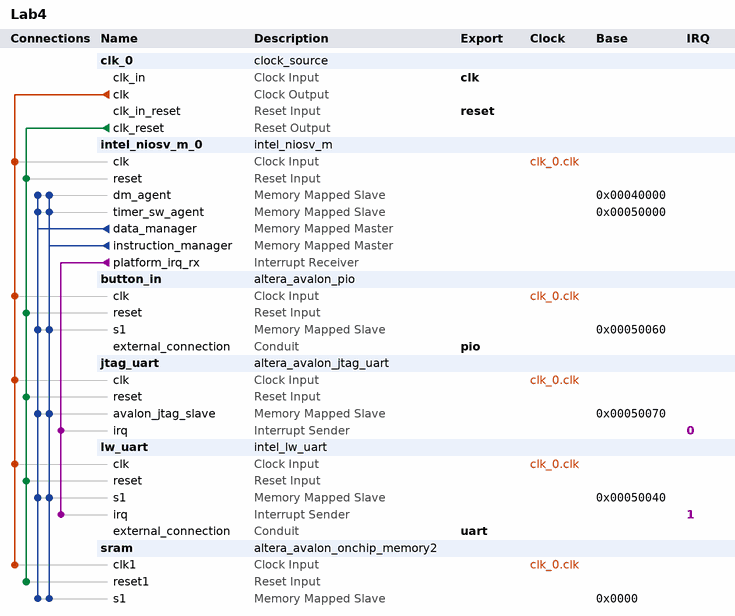
[diagram p0: system contents]
# Platform Designer (Qsys) system Lab4, Cyclone V 5CSXFC6D6F31C6
# Parameters at their usual value, and those the tool derives, are not listed.
package require -exact qsys 25.1
create_system Lab4
set_project_property DEVICE_FAMILY {Cyclone V}
set_project_property DEVICE 5CSXFC6D6F31C6

add_instance clk_0 clock_source 25.1
set_instance_parameter_value clk_0 clockFrequency 50000000

add_instance intel_niosv_m_0 intel_niosv_m 26.0.0
set_instance_parameter_value intel_niosv_m_0 enableAvalonInterface false
set_instance_parameter_value intel_niosv_m_0 enableDebugReset false
set_instance_parameter_value intel_niosv_m_0 enableECCFull false
set_instance_parameter_value intel_niosv_m_0 enableECCLite false
set_instance_parameter_value intel_niosv_m_0 hartId 0
set_instance_parameter_value intel_niosv_m_0 interruptMode 0
set_instance_parameter_value intel_niosv_m_0 pipelineArch true
set_instance_parameter_value intel_niosv_m_0 resetSlave Absolute

add_instance button_in altera_avalon_pio 25.1
set_instance_parameter_value button_in direction Input
set_instance_parameter_value button_in width 8

add_instance jtag_uart altera_avalon_jtag_uart 25.1
set_instance_parameter_value jtag_uart simInteractiveOptions NO_INTERACTIVE_WINDOWS

add_instance lw_uart intel_lw_uart 25.1
set_instance_parameter_value lw_uart baud 9600
set_instance_parameter_value lw_uart dataBits 8
set_instance_parameter_value lw_uart fixedBaud true
set_instance_parameter_value lw_uart parity NONE
set_instance_parameter_value lw_uart rxfifoAlmostFullValue 1
set_instance_parameter_value lw_uart rxfifoDepth 8
set_instance_parameter_value lw_uart simTrueBaud false
set_instance_parameter_value lw_uart stopBits 1
set_instance_parameter_value lw_uart syncRegDepth 2
set_instance_parameter_value lw_uart txfifoDepth 8
set_instance_parameter_value lw_uart useCtsRts false
set_instance_parameter_value lw_uart useEopRegister false
set_instance_parameter_value lw_uart useRegRXFIFO false
set_instance_parameter_value lw_uart useRegTXFIFO false

add_instance sram altera_avalon_onchip_memory2 25.1
set_instance_parameter_value sram dataWidth 32
set_instance_parameter_value sram dualPort false
set_instance_parameter_value sram initMemContent true
set_instance_parameter_value sram initializationFileName onchip_mem.hex
set_instance_parameter_value sram memorySize 204800

# connections
add_connection clk_0.clk button_in.clk clock
add_connection clk_0.clk intel_niosv_m_0.clk clock
add_connection clk_0.clk jtag_uart.clk clock
add_connection clk_0.clk lw_uart.clk clock
add_connection clk_0.clk sram.clk1 clock
add_connection clk_0.clk_reset button_in.reset reset
add_connection clk_0.clk_reset intel_niosv_m_0.reset reset
add_connection clk_0.clk_reset jtag_uart.reset reset
add_connection clk_0.clk_reset lw_uart.reset reset
add_connection clk_0.clk_reset sram.reset1 reset
add_connection intel_niosv_m_0.data_manager button_in.s1 avalon
set_connection_parameter_value intel_niosv_m_0.data_manager/button_in.s1 baseAddress 0x00050060
add_connection intel_niosv_m_0.data_manager intel_niosv_m_0.dm_agent avalon
set_connection_parameter_value intel_niosv_m_0.data_manager/intel_niosv_m_0.dm_agent baseAddress 0x00040000
add_connection intel_niosv_m_0.data_manager intel_niosv_m_0.timer_sw_agent avalon
set_connection_parameter_value intel_niosv_m_0.data_manager/intel_niosv_m_0.timer_sw_agent baseAddress 0x00050000
add_connection intel_niosv_m_0.data_manager jtag_uart.avalon_jtag_slave avalon
set_connection_parameter_value intel_niosv_m_0.data_manager/jtag_uart.avalon_jtag_slave baseAddress 0x00050070
add_connection intel_niosv_m_0.data_manager lw_uart.s1 avalon
set_connection_parameter_value intel_niosv_m_0.data_manager/lw_uart.s1 baseAddress 0x00050040
add_connection intel_niosv_m_0.data_manager sram.s1 avalon
set_connection_parameter_value intel_niosv_m_0.data_manager/sram.s1 baseAddress 0x0000
add_connection intel_niosv_m_0.instruction_manager button_in.s1 avalon
set_connection_parameter_value intel_niosv_m_0.instruction_manager/button_in.s1 baseAddress 0x00050060
add_connection intel_niosv_m_0.instruction_manager intel_niosv_m_0.dm_agent avalon
set_connection_parameter_value intel_niosv_m_0.instruction_manager/intel_niosv_m_0.dm_agent baseAddress 0x00040000
add_connection intel_niosv_m_0.instruction_manager intel_niosv_m_0.timer_sw_agent avalon
set_connection_parameter_value intel_niosv_m_0.instruction_manager/intel_niosv_m_0.timer_sw_agent baseAddress 0x00050000
add_connection intel_niosv_m_0.instruction_manager jtag_uart.avalon_jtag_slave avalon
set_connection_parameter_value intel_niosv_m_0.instruction_manager/jtag_uart.avalon_jtag_slave baseAddress 0x00050070
add_connection intel_niosv_m_0.instruction_manager lw_uart.s1 avalon
set_connection_parameter_value intel_niosv_m_0.instruction_manager/lw_uart.s1 baseAddress 0x00050040
add_connection intel_niosv_m_0.instruction_manager sram.s1 avalon
set_connection_parameter_value intel_niosv_m_0.instruction_manager/sram.s1 baseAddress 0x0000
add_connection intel_niosv_m_0.platform_irq_rx jtag_uart.irq interrupt
set_connection_parameter_value intel_niosv_m_0.platform_irq_rx/jtag_uart.irq irqNumber 0
add_connection intel_niosv_m_0.platform_irq_rx lw_uart.irq interrupt
set_connection_parameter_value intel_niosv_m_0.platform_irq_rx/lw_uart.irq irqNumber 1

# exported interfaces
add_interface clk clock sink
set_interface_property clk EXPORT_OF clk_0.clk_in
add_interface pio conduit end
set_interface_property pio EXPORT_OF button_in.external_connection
add_interface reset reset sink
set_interface_property reset EXPORT_OF clk_0.clk_in_reset
add_interface uart conduit end
set_interface_property uart EXPORT_OF lw_uart.external_connection

set_interconnect_requirement {$system} qsys_mm.clockCrossingAdapter HANDSHAKE
set_interconnect_requirement {$system} qsys_mm.enableEccProtection FALSE
set_interconnect_requirement {$system} qsys_mm.insertDefaultSlave FALSE
set_interconnect_requirement {$system} qsys_mm.maxAdditionalLatency 1

save_system Lab4.qsys
